# Altium project Module_Relay_UART_CAN.PrjPcb
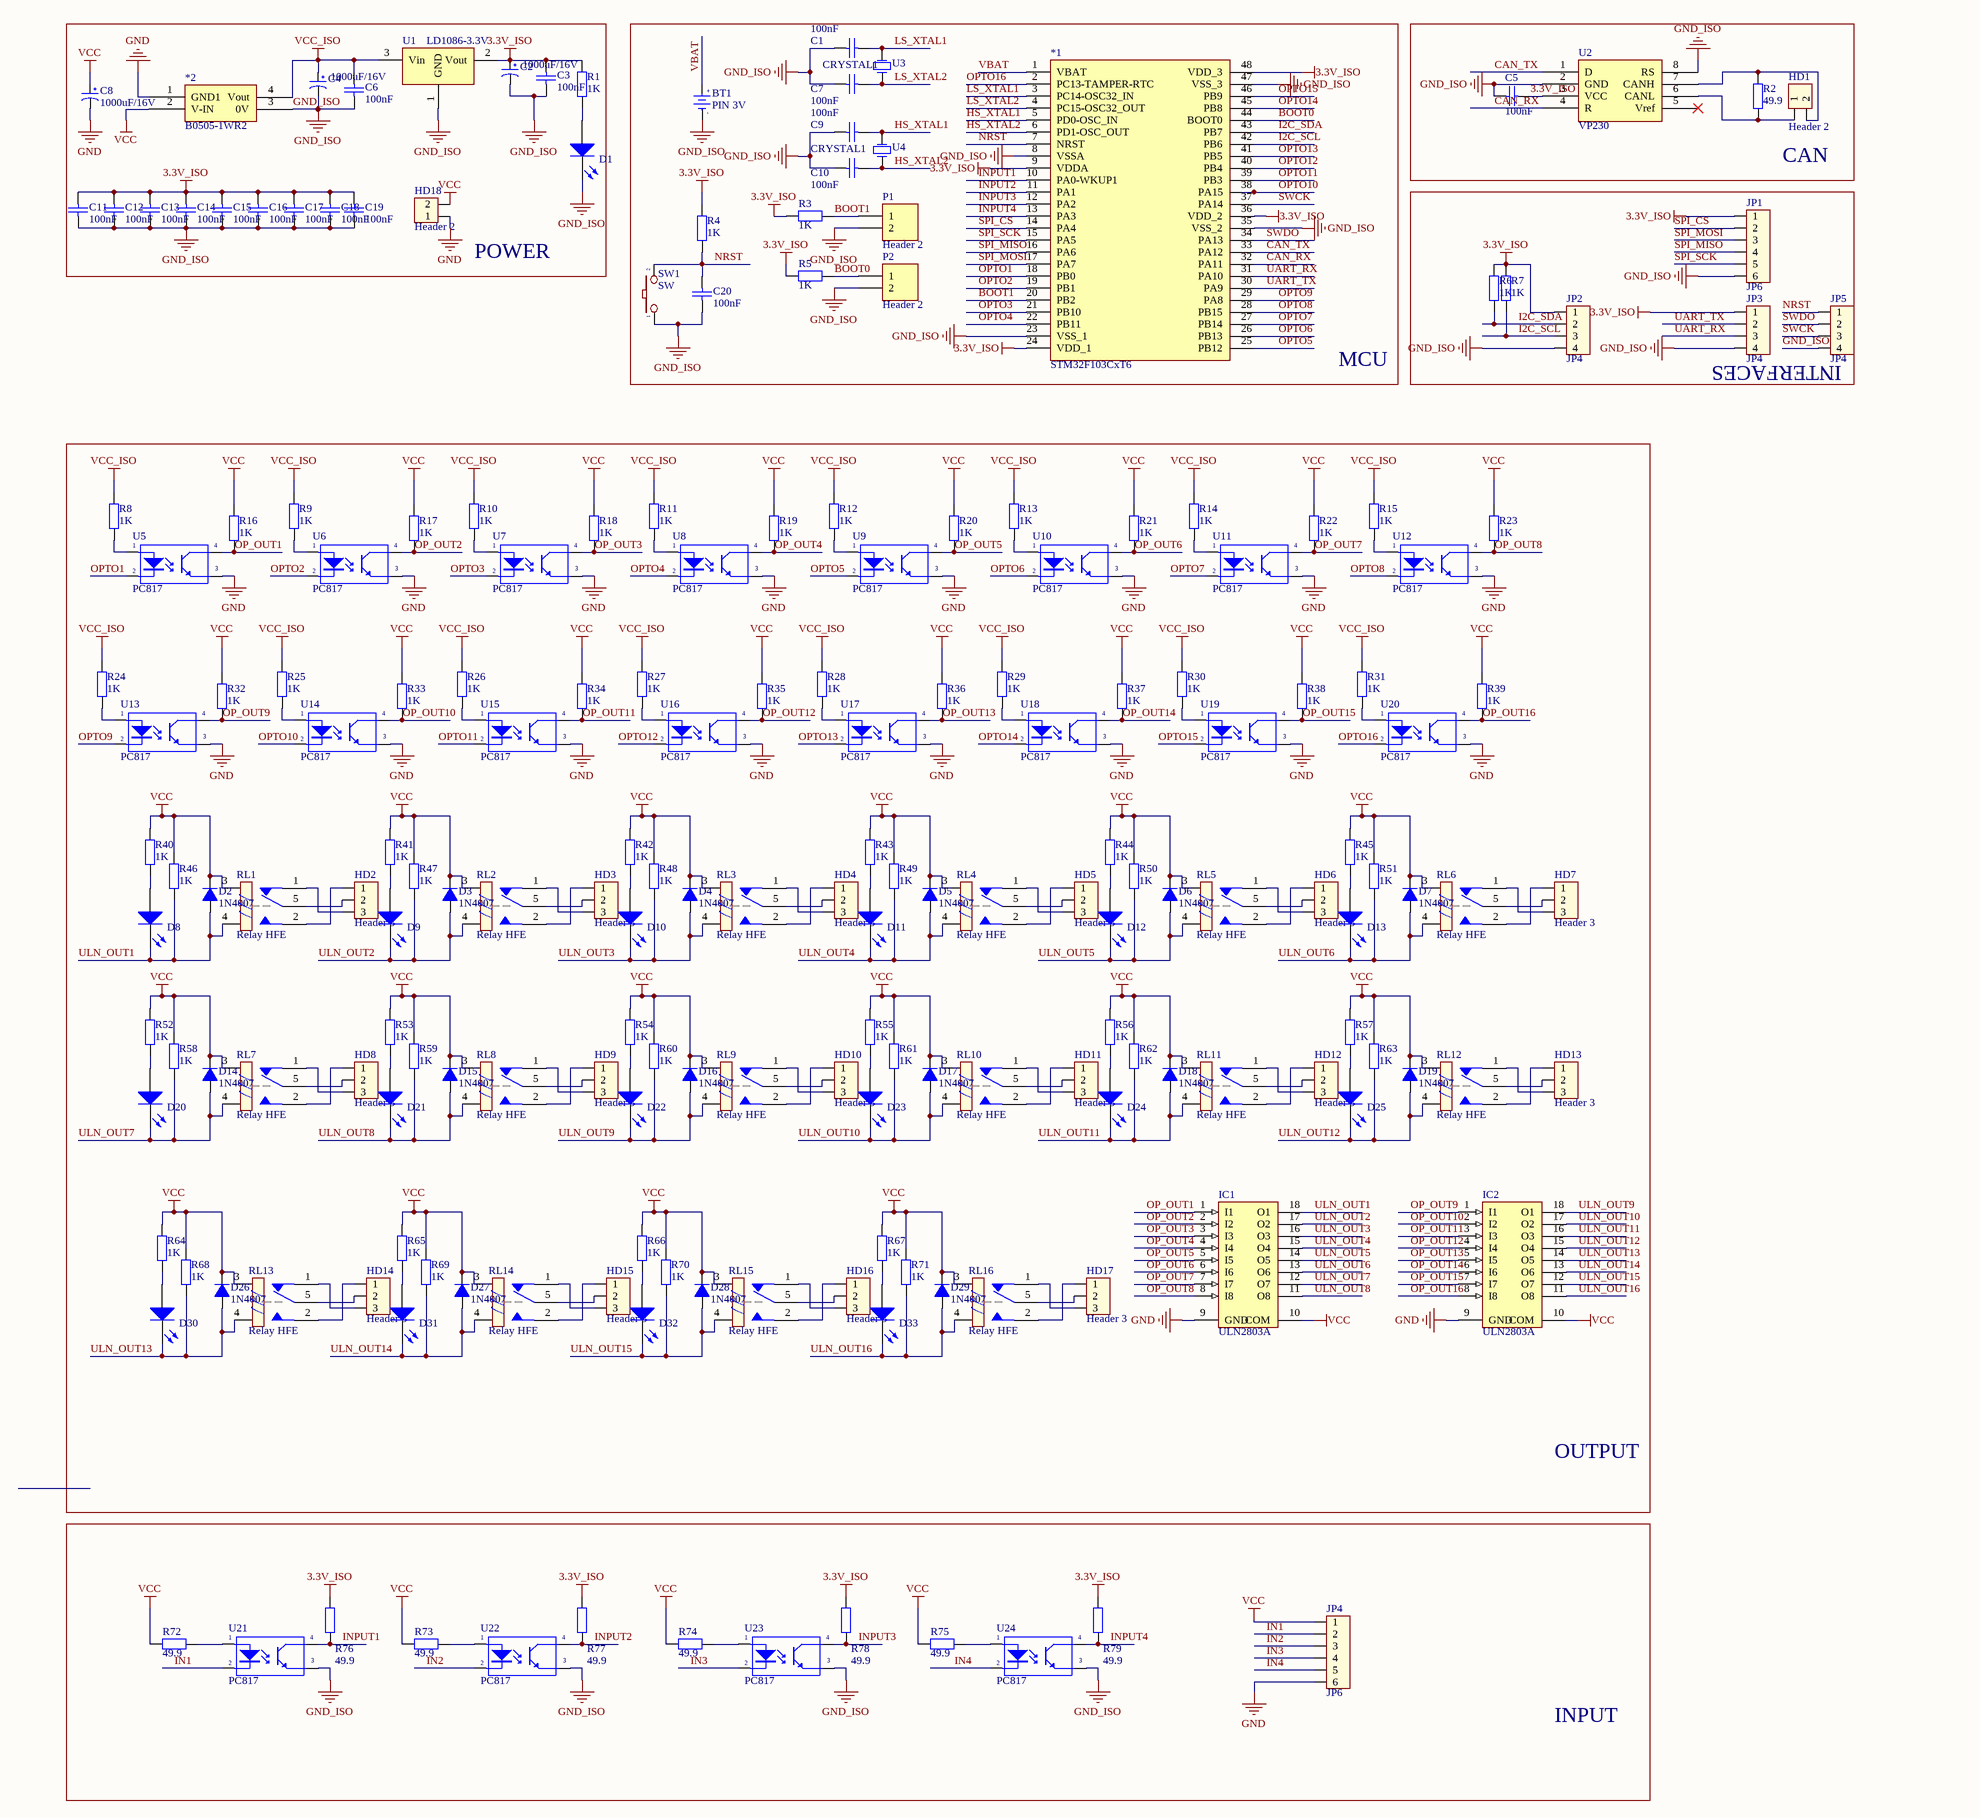
[diagram p0: Module_Relay_UART_CAN.SchDoc]
1 sheet, 203 parts. Net scope: global (net labels, ports and power ports of the same name join across sheets).
Board file: Module_Relay_UART_CAN.PcbDoc

## Sheet Module_Relay_UART_CAN.SchDoc
size A2

### Parts
*1  STM32F103CxT6  [LQFP48_N]
*2  B0505-1WR2  [B0505-1WR2]
BT1  PIN 3V  [CR1220]
C1  CAP: 100nF  [CAP0805]  (hidden comment: CAP)
C2  1000uF/16V  [CAP2917]
C3  CAP: 100nF  [CAP0805]  (hidden comment: CAP)
C4  1000uF/16V  [CAP2917]
C5  CAP: 100nF  [CAP0805]  (hidden comment: CAP)
C6  CAP: 100nF  [CAP0805]  (hidden comment: CAP)
C7  CAP: 100nF  [CAP0805]  (hidden comment: CAP)
C8  1000uF/16V  [CAP2917]
C9  CAP: 100nF  [CAP0805]  (hidden comment: CAP)
C10  CAP: 100nF  [CAP0805]  (hidden comment: CAP)
C11  CAP: 100nF  [CAP0805]  (hidden comment: CAP)
C12  CAP: 100nF  [CAP0805]  (hidden comment: CAP)
C13  CAP: 100nF  [CAP0805]  (hidden comment: CAP)
C14  CAP: 100nF  [CAP0805]  (hidden comment: CAP)
C15  CAP: 100nF  [CAP0805]  (hidden comment: CAP)
C16  CAP: 100nF  [CAP0805]  (hidden comment: CAP)
C17  CAP: 100nF  [CAP0805]  (hidden comment: CAP)
C18  CAP: 100nF  [CAP0805]  (hidden comment: CAP)
C19  CAP: 100nF  [CAP0805]  (hidden comment: CAP)
C20  CAP: 100nF  [CAP0805]  (hidden comment: CAP)
D1  LED  [LED0805]  (value not drawn)
D2  1N4007  [D1A]
D3  1N4007  [D1A]
D4  1N4007  [D1A]
D5  1N4007  [D1A]
D6  1N4007  [D1A]
D7  1N4007  [D1A]
D8  LED  [LED0805]  (value not drawn)
D9  LED  [LED0805]  (value not drawn)
D10  LED  [LED0805]  (value not drawn)
D11  LED  [LED0805]  (value not drawn)
D12  LED  [LED0805]  (value not drawn)
D13  LED  [LED0805]  (value not drawn)
D14  1N4007  [D1A]
D15  1N4007  [D1A]
D16  1N4007  [D1A]
D17  1N4007  [D1A]
D18  1N4007  [D1A]
D19  1N4007  [D1A]
D20  LED  [LED0805]  (value not drawn)
D21  LED  [LED0805]  (value not drawn)
D22  LED  [LED0805]  (value not drawn)
D23  LED  [LED0805]  (value not drawn)
D24  LED  [LED0805]  (value not drawn)
D25  LED  [LED0805]  (value not drawn)
D26  1N4007  [D1A]
D27  1N4007  [D1A]
D28  1N4007  [D1A]
D29  1N4007  [D1A]
D30  LED  [LED0805]  (value not drawn)
D31  LED  [LED0805]  (value not drawn)
D32  LED  [LED0805]  (value not drawn)
D33  LED  [LED0805]  (value not drawn)
HD1  Header 2  [HED2T]
HD2  Header 3  [HED3T]
HD3  Header 3  [HED3T]
HD4  Header 3  [HED3T]
HD5  Header 3  [HED3T]
HD6  Header 3  [HED3T]
HD7  Header 3  [HED3T]
HD8  Header 3  [HED3T]
HD9  Header 3  [HED3T]
HD10  Header 3  [HED3T]
HD11  Header 3  [HED3T]
HD12  Header 3  [HED3T]
HD13  Header 3  [HED3T]
HD14  Header 3  [HED3T]
HD15  Header 3  [HED3T]
HD16  Header 3  [HED3T]
HD17  Header 3  [HED3T]
HD18  Header 2  [HED2T]
IC1  ULN2803A  [SOP18]
IC2  ULN2803A  [SOP18]
JP1  JP6  [CON6]
JP2  JP4  [CON4]
JP3  JP4  [CON4]
JP4  JP6  [CON6]
JP5  JP4  [CON4]
P1  Header 2  [HDR1X2]
P2  Header 2  [HDR1X2]
R1  RES: 1K  [0805]  (hidden comment: RES)
R2  RES: 49.9  [0805]  (hidden comment: RES)
R3  RES: 1K  [0805]  (hidden comment: RES)
R4  RES: 1K  [0805]  (hidden comment: RES)
R5  RES: 1K  [0805]  (hidden comment: RES)
R6  RES: 1K  [0805]  (hidden comment: RES)
R7  RES: 1K  [0805]  (hidden comment: RES)
R8  RES: 1K  [0805]  (hidden comment: RES)
R9  RES: 1K  [0805]  (hidden comment: RES)
R10  RES: 1K  [0805]  (hidden comment: RES)
R11  RES: 1K  [0805]  (hidden comment: RES)
R12  RES: 1K  [0805]  (hidden comment: RES)
R13  RES: 1K  [0805]  (hidden comment: RES)
R14  RES: 1K  [0805]  (hidden comment: RES)
R15  RES: 1K  [0805]  (hidden comment: RES)
R16  RES: 1K  [0805]  (hidden comment: RES)
R17  RES: 1K  [0805]  (hidden comment: RES)
R18  RES: 1K  [0805]  (hidden comment: RES)
R19  RES: 1K  [0805]  (hidden comment: RES)
R20  RES: 1K  [0805]  (hidden comment: RES)
R21  RES: 1K  [0805]  (hidden comment: RES)
R22  RES: 1K  [0805]  (hidden comment: RES)
R23  RES: 1K  [0805]  (hidden comment: RES)
R24  RES: 1K  [0805]  (hidden comment: RES)
R25  RES: 1K  [0805]  (hidden comment: RES)
R26  RES: 1K  [0805]  (hidden comment: RES)
R27  RES: 1K  [0805]  (hidden comment: RES)
R28  RES: 1K  [0805]  (hidden comment: RES)
R29  RES: 1K  [0805]  (hidden comment: RES)
R30  RES: 1K  [0805]  (hidden comment: RES)
R31  RES: 1K  [0805]  (hidden comment: RES)
R32  RES: 1K  [0805]  (hidden comment: RES)
R33  RES: 1K  [0805]  (hidden comment: RES)
R34  RES: 1K  [0805]  (hidden comment: RES)
R35  RES: 1K  [0805]  (hidden comment: RES)
R36  RES: 1K  [0805]  (hidden comment: RES)
R37  RES: 1K  [0805]  (hidden comment: RES)
R38  RES: 1K  [0805]  (hidden comment: RES)
R39  RES: 1K  [0805]  (hidden comment: RES)
R40  RES: 1K  [0805]  (hidden comment: RES)
R41  RES: 1K  [0805]  (hidden comment: RES)
R42  RES: 1K  [0805]  (hidden comment: RES)
R43  RES: 1K  [0805]  (hidden comment: RES)
R44  RES: 1K  [0805]  (hidden comment: RES)
R45  RES: 1K  [0805]  (hidden comment: RES)
R46  RES: 1K  [0805]  (hidden comment: RES)
R47  RES: 1K  [0805]  (hidden comment: RES)
R48  RES: 1K  [0805]  (hidden comment: RES)
R49  RES: 1K  [0805]  (hidden comment: RES)
R50  RES: 1K  [0805]  (hidden comment: RES)
R51  RES: 1K  [0805]  (hidden comment: RES)
R52  RES: 1K  [0805]  (hidden comment: RES)
R53  RES: 1K  [0805]  (hidden comment: RES)
R54  RES: 1K  [0805]  (hidden comment: RES)
R55  RES: 1K  [0805]  (hidden comment: RES)
R56  RES: 1K  [0805]  (hidden comment: RES)
R57  RES: 1K  [0805]  (hidden comment: RES)
R58  RES: 1K  [0805]  (hidden comment: RES)
R59  RES: 1K  [0805]  (hidden comment: RES)
R60  RES: 1K  [0805]  (hidden comment: RES)
R61  RES: 1K  [0805]  (hidden comment: RES)
R62  RES: 1K  [0805]  (hidden comment: RES)
R63  RES: 1K  [0805]  (hidden comment: RES)
R64  RES: 1K  [0805]  (hidden comment: RES)
R65  RES: 1K  [0805]  (hidden comment: RES)
R66  RES: 1K  [0805]  (hidden comment: RES)
R67  RES: 1K  [0805]  (hidden comment: RES)
R68  RES: 1K  [0805]  (hidden comment: RES)
R69  RES: 1K  [0805]  (hidden comment: RES)
R70  RES: 1K  [0805]  (hidden comment: RES)
R71  RES: 1K  [0805]  (hidden comment: RES)
R72  RES: 49.9  [0805]  (hidden comment: RES)
R73  RES: 49.9  [0805]  (hidden comment: RES)
R74  RES: 49.9  [0805]  (hidden comment: RES)
R75  RES: 49.9  [0805]  (hidden comment: RES)
R76  RES: 49.9  [0805]  (hidden comment: RES)
R77  RES: 49.9  [0805]  (hidden comment: RES)
R78  RES: 49.9  [0805]  (hidden comment: RES)
R79  RES: 49.9  [0805]  (hidden comment: RES)
RL1  Relay HFE  [RELAY HFE]
RL2  Relay HFE  [RELAY HFE]
RL3  Relay HFE  [RELAY HFE]
RL4  Relay HFE  [RELAY HFE]
RL5  Relay HFE  [RELAY HFE]
RL6  Relay HFE  [RELAY HFE]
RL7  Relay HFE  [RELAY HFE]
RL8  Relay HFE  [RELAY HFE]
RL9  Relay HFE  [RELAY HFE]
RL10  Relay HFE  [RELAY HFE]
RL11  Relay HFE  [RELAY HFE]
RL12  Relay HFE  [RELAY HFE]
RL13  Relay HFE  [RELAY HFE]
RL14  Relay HFE  [RELAY HFE]
RL15  Relay HFE  [RELAY HFE]
RL16  Relay HFE  [RELAY HFE]
SW1  SW  [SW2PIN-HT]
U1  LD1086-3.3V  [SOT223_L]
U2  VP230  [SO-8]
U3  CRYSTAL1  [0805]
U4  CRYSTAL1  [CRYSTAL2]
U5  PC817  [DIP4/W0.3]
U6  PC817  [DIP4/W0.3]
U7  PC817  [DIP4/W0.3]
U8  PC817  [DIP4/W0.3]
U9  PC817  [DIP4/W0.3]
U10  PC817  [DIP4/W0.3]
U11  PC817  [DIP4/W0.3]
U12  PC817  [DIP4/W0.3]
U13  PC817  [DIP4/W0.3]
U14  PC817  [DIP4/W0.3]
U15  PC817  [DIP4/W0.3]
U16  PC817  [DIP4/W0.3]
U17  PC817  [DIP4/W0.3]
U18  PC817  [DIP4/W0.3]
U19  PC817  [DIP4/W0.3]
U20  PC817  [DIP4/W0.3]
U21  PC817  [DIP4/W0.3]
U22  PC817  [DIP4/W0.3]
U23  PC817  [DIP4/W0.3]
U24  PC817  [DIP4/W0.3]

### Blocks framed on the sheet
POWER: *2 C2-C4 C6 C8 C11-C19 D1 HD18 R1 U1
MCU: *1 BT1 C1 C7 C9 C10 C20 P1 P2 R3-R5 SW1 U3 U4
CAN: C5 HD1 R2 U2
INTERFACES: JP1-JP3 JP5 R6 R7
OUTPUT: D2-D33 HD2-HD17 IC1 IC2 R8-R71 RL1-RL16 U5-U20
INPUT: JP4 R72-R79 U21-U24

### Nets
3.3V_ISO: *1.9(VDDA) *1.24(VDD_1) *1.36(VDD_2) *1.48(VDD_3) C2.1 C3.1 C5.2 C11.1 C12.1 C13.1 C14.1 C15.1 C16.1 C17.1 C18.1 C19.1 JP1.1 JP2.1 JP3.1 R1.2 R3.2 R4.2 R5.2 R6.2 R7.2 R76.2 R77.2 R78.2 R79.2 U1.2(Vout) U2.3(VCC)
GND: *2.1(GND1) C8.2 HD18.1 IC1.9(GND) IC2.9(GND) JP4.6 U5.3(E) U6.3(E) U7.3(E) U8.3(E) U9.3(E) U10.3(E) U11.3(E) U12.3(E) U13.3(E) U14.3(E) U15.3(E) U16.3(E) U17.3(E) U18.3(E) U19.3(E) U20.3(E)
GND_ISO: *1.8(VSSA) *1.23(VSS_1) *1.35(VSS_2) *1.47(VSS_3) *2.3(0V) BT1.2(GND) C1.2 C2.2 C3.2 C4.2 C5.1 C6.2 C7.2 C9.2 C10.2 C11.2 C12.2 C13.2 C14.2 C15.2 C16.2 C17.2 C18.2 C19.2 C20.2 D1.2(K) JP1.6 JP2.4 JP3.4 JP5.4 P1.2 P2.2 SW1.1 U1.1(GND) U2.2(GND) U2.8(RS) U21.3(E) U22.3(E) U23.3(E) U24.3(E)
VCC: *2.2(V-IN) C8.1 D2.2(K) D3.2(K) D4.2(K) D5.2(K) D6.2(K) D7.2(K) D14.2(K) D15.2(K) D16.2(K) D17.2(K) D18.2(K) D19.2(K) D26.2(K) D27.2(K) D28.2(K) D29.2(K) HD18.2 IC1.10(COM) IC2.10(COM) JP4.1 R16.2 R17.2 R18.2 R19.2 R20.2 R21.2 R22.2 R23.2 R32.2 R33.2 R34.2 R35.2 R36.2 R37.2 R38.2 R39.2 R40.2 R41.2 R42.2 R43.2 R44.2 R45.2 R46.2 R47.2 R48.2 R49.2 R50.2 R51.2 R52.2 R53.2 R54.2 R55.2 R56.2 R57.2 R58.2 R59.2 R60.2 R61.2 R62.2 R63.2 R64.2 R65.2 R66.2 R67.2 R68.2 R69.2 R70.2 R71.2 R72.1 R73.1 R74.1 R75.1 RL1.3 RL2.3 RL3.3 RL4.3 RL5.3 RL6.3 RL7.3 RL8.3 RL9.3 RL10.3 RL11.3 RL12.3 RL13.3 RL14.3 RL15.3 RL16.3
VCC_ISO: *2.4(Vout) C4.1 C6.1 R8.1 R9.1 R10.1 R11.1 R12.1 R13.1 R14.1 R15.1 R24.1 R25.1 R26.1 R27.1 R28.1 R29.1 R30.1 R31.1 U1.3(Vin)
BOOT0: *1.44(BOOT0) P2.1 R5.1
BOOT1: *1.20(PB2) P1.1 R3.1
CAN_RX: *1.32(PA11) U2.4(R)
CAN_TX: *1.33(PA12) U2.1(D)
HS_XTAL1: *1.5(PD0-OSC_IN) C9.1 U4.2(OSC2)
HS_XTAL2: *1.6(PD1-OSC_OUT) C10.1 U4.1(OSC1)
I2C_SCL: *1.42(PB6) JP2.3 R7.1
I2C_SDA: *1.43(PB7) JP2.2 R6.1
IN1: JP4.2 U21.2(K)
IN2: JP4.3 U22.2(K)
IN3: JP4.4 U23.2(K)
IN4: JP4.5 U24.2(K)
INPUT1: *1.10(PA0-WKUP1) R76.1 U21.4(C)
INPUT2: *1.11(PA1) R77.1 U22.4(C)
INPUT3: *1.12(PA2) R78.1 U23.4(C)
INPUT4: *1.13(PA3) R79.1 U24.4(C)
LS_XTAL1: *1.3(PC14-OSC32_IN) C1.1 U3.2(OSC2)
LS_XTAL2: *1.4(PC15-OSC32_OUT) C7.1 U3.1(OSC1)
NRST: *1.7(NRST) C20.1 JP5.1 R4.1 SW1.2
OP_OUT1: IC1.1(I1) R16.1 U5.4(C)
OP_OUT2: IC1.2(I2) R17.1 U6.4(C)
OP_OUT3: IC1.3(I3) R18.1 U7.4(C)
OP_OUT4: IC1.4(I4) R19.1 U8.4(C)
OP_OUT5: IC1.5(I5) R20.1 U9.4(C)
OP_OUT6: IC1.6(I6) R21.1 U10.4(C)
OP_OUT7: IC1.7(I7) R22.1 U11.4(C)
OP_OUT8: IC1.8(I8) R23.1 U12.4(C)
OP_OUT9: IC2.1(I1) R32.1 U13.4(C)
OP_OUT10: IC2.2(I2) R33.1 U14.4(C)
OP_OUT11: IC2.3(I3) R34.1 U15.4(C)
OP_OUT12: IC2.4(I4) R35.1 U16.4(C)
OP_OUT13: IC2.5(I5) R36.1 U17.4(C)
OP_OUT14: IC2.6(I6) R37.1 U18.4(C)
OP_OUT15: IC2.7(I7) R38.1 U19.4(C)
OP_OUT16: IC2.8(I8) R39.1 U20.4(C)
OPTO1: *1.18(PB0) U5.2(K)
OPTO2: *1.19(PB1) U6.2(K)
OPTO3: *1.21(PB10) U7.2(K)
OPTO4: *1.22(PB11) U8.2(K)
OPTO5: *1.25(PB12) U9.2(K)
OPTO6: *1.26(PB13) U10.2(K)
OPTO7: *1.27(PB14) U11.2(K)
OPTO8: *1.28(PB15) U12.2(K)
OPTO9: *1.29(PA8) U13.2(K)
OPTO10: *1.38(PA15) U14.2(K)
OPTO11: *1.39(PB3) U15.2(K)
OPTO12: *1.40(PB4) U16.2(K)
OPTO13: *1.41(PB5) U17.2(K)
OPTO14: *1.45(PB8) U18.2(K)
OPTO15: *1.46(PB9) U19.2(K)
OPTO16: *1.2(PC13-TAMPER-RTC) U20.2(K)
SPI_CS: *1.14(PA4) JP1.2
SPI_MISO: *1.16(PA6) JP1.4
SPI_MOSI: *1.17(PA7) JP1.3
SPI_SCK: *1.15(PA5) JP1.5
SWCK: *1.37(PA14) JP5.3
SWDO: *1.34(PA13) JP5.2
UART_RX: *1.31(PA10) JP3.3
UART_TX: *1.30(PA9) JP3.2
ULN_OUT1: D2.1(A) D8.2(K) IC1.18(O1) R46.1 RL1.4
ULN_OUT2: D3.1(A) D9.2(K) IC1.17(O2) R47.1 RL2.4
ULN_OUT3: D4.1(A) D10.2(K) IC1.16(O3) R48.1 RL3.4
ULN_OUT4: D5.1(A) D11.2(K) IC1.15(O4) R49.1 RL4.4
ULN_OUT5: D6.1(A) D12.2(K) IC1.14(O5) R50.1 RL5.4
ULN_OUT6: D7.1(A) D13.2(K) IC1.13(O6) R51.1 RL6.4
ULN_OUT7: D14.1(A) D20.2(K) IC1.12(O7) R58.1 RL7.4
ULN_OUT8: D15.1(A) D21.2(K) IC1.11(O8) R59.1 RL8.4
ULN_OUT9: D16.1(A) D22.2(K) IC2.18(O1) R60.1 RL9.4
ULN_OUT10: D17.1(A) D23.2(K) IC2.17(O2) R61.1 RL10.4
ULN_OUT11: D18.1(A) D24.2(K) IC2.16(O3) R62.1 RL11.4
ULN_OUT12: D19.1(A) D25.2(K) IC2.15(O4) R63.1 RL12.4
ULN_OUT13: D26.1(A) D30.2(K) IC2.14(O5) R68.1 RL13.4
ULN_OUT14: D27.1(A) D31.2(K) IC2.13(O6) R69.1 RL14.4
ULN_OUT15: D28.1(A) D32.2(K) IC2.12(O7) R70.1 RL15.4
ULN_OUT16: D29.1(A) D33.2(K) IC2.11(O8) R71.1 RL16.4
VBAT: *1.1(VBAT) BT1.1(+3V)
NetD1_1: D1.1(A) R1.1
NetD8_1: D8.1(A) R40.1
NetD9_1: D9.1(A) R41.1
NetD10_1: D10.1(A) R42.1
NetD11_1: D11.1(A) R43.1
NetD12_1: D12.1(A) R44.1
NetD13_1: D13.1(A) R45.1
NetD20_1: D20.1(A) R52.1
NetD21_1: D21.1(A) R53.1
NetD22_1: D22.1(A) R54.1
NetD23_1: D23.1(A) R55.1
NetD24_1: D24.1(A) R56.1
NetD25_1: D25.1(A) R57.1
NetD30_1: D30.1(A) R64.1
NetD31_1: D31.1(A) R65.1
NetD32_1: D32.1(A) R66.1
NetD33_1: D33.1(A) R67.1
NetHD1_1: HD1.1 R2.2 U2.6(CANL)
NetHD1_2: HD1.2 R2.1 U2.7(CANH)
NetHD2_1: HD2.1 RL1.2
NetHD2_2: HD2.2 RL1.5
NetHD2_3: HD2.3 RL1.1
NetHD3_1: HD3.1 RL2.2
NetHD3_2: HD3.2 RL2.5
NetHD3_3: HD3.3 RL2.1
NetHD4_1: HD4.1 RL3.2
NetHD4_2: HD4.2 RL3.5
NetHD4_3: HD4.3 RL3.1
NetHD5_1: HD5.1 RL4.2
NetHD5_2: HD5.2 RL4.5
NetHD5_3: HD5.3 RL4.1
NetHD6_1: HD6.1 RL5.2
NetHD6_2: HD6.2 RL5.5
NetHD6_3: HD6.3 RL5.1
NetHD7_1: HD7.1 RL6.2
NetHD7_2: HD7.2 RL6.5
NetHD7_3: HD7.3 RL6.1
NetHD8_1: HD8.1 RL7.2
NetHD8_2: HD8.2 RL7.5
NetHD8_3: HD8.3 RL7.1
NetHD9_1: HD9.1 RL8.2
NetHD9_2: HD9.2 RL8.5
NetHD9_3: HD9.3 RL8.1
NetHD10_1: HD10.1 RL9.2
NetHD10_2: HD10.2 RL9.5
NetHD10_3: HD10.3 RL9.1
NetHD11_1: HD11.1 RL10.2
NetHD11_2: HD11.2 RL10.5
NetHD11_3: HD11.3 RL10.1
NetHD12_1: HD12.1 RL11.2
NetHD12_2: HD12.2 RL11.5
NetHD12_3: HD12.3 RL11.1
NetHD13_1: HD13.1 RL12.2
NetHD13_2: HD13.2 RL12.5
NetHD13_3: HD13.3 RL12.1
NetHD14_1: HD14.1 RL13.2
NetHD14_2: HD14.2 RL13.5
NetHD14_3: HD14.3 RL13.1
NetHD15_1: HD15.1 RL14.2
NetHD15_2: HD15.2 RL14.5
NetHD15_3: HD15.3 RL14.1
NetHD16_1: HD16.1 RL15.2
NetHD16_2: HD16.2 RL15.5
NetHD16_3: HD16.3 RL15.1
NetHD17_1: HD17.1 RL16.2
NetHD17_2: HD17.2 RL16.5
NetHD17_3: HD17.3 RL16.1
NetR8_2: R8.2 U5.1(A)
NetR9_2: R9.2 U6.1(A)
NetR10_2: R10.2 U7.1(A)
NetR11_2: R11.2 U8.1(A)
NetR12_2: R12.2 U9.1(A)
NetR13_2: R13.2 U10.1(A)
NetR14_2: R14.2 U11.1(A)
NetR15_2: R15.2 U12.1(A)
NetR24_2: R24.2 U13.1(A)
NetR25_2: R25.2 U14.1(A)
NetR26_2: R26.2 U15.1(A)
NetR27_2: R27.2 U16.1(A)
NetR28_2: R28.2 U17.1(A)
NetR29_2: R29.2 U18.1(A)
NetR30_2: R30.2 U19.1(A)
NetR31_2: R31.2 U20.1(A)
NetR72_2: R72.2 U21.1(A)
NetR73_2: R73.2 U22.1(A)
NetR74_2: R74.2 U23.1(A)
NetR75_2: R75.2 U24.1(A)

Not connected (* = marked no-connect by the designer): U2 5(Vref)*

### Notes on the sheet
- (in symbol PIN 3V) +; -

### Library data of the parts
BT1 = PIN 3V: Battery 3VDC; Value: PIN 3V
C2 C4 C8 = CP4: Cap 1000uF/16V - 220uF/50V; Description 5: 4,7uF>10uF/250V_3,3uF>10uF/400V - 2,2uF>4,7uF/450V; Description 1: 2200uF-3300uF/6,3V - 1000uF-2200uF/10V; Description 2: 1000uF/16V - 470uF => 1000uF/25V - 100uF/100V; Description 3: 330uF>470uF/35V_220uF>470uF/50V_10uF>22uF/250V; Description 4: 220uF => 330uF/63V - 10uF =>33uF/160 - 200V; Value: 1000uF/16V
D1 D8-D13 D20-D25 D30-D33 = LED1
D2-D7 D14-D19 D26-D29 = D1A: Diode 1A; Value: 1N4007
HD1 HD18 = Hed2: Header 2 (Green); Value: Header 2
HD2-HD17 = Hed3: Header 3 (Green); Value: Header 3
IC1 IC2 = ULN2803A: High-Voltage, High-Current Darlington Array; LatestRevisionNote: Stylized 3D Model Added.; Publisher: Altium Limited; Value: ULN2803A
JP1 JP4 = Con6: Connector 6; Value: Connector 6
JP2 JP3 JP5 = Con4: Connector 4; Value: Connector 4
P1 P2 = Header 2: Header, 2-Pin; LatestRevisionDate: 17-Jul-2002; LatestRevisionNote: Re-released for DXP Platform.; Publisher: Altium Limited
RL1-RL16 = Relay HFE: Relay SPDT,10A - 12VDC 5 Pin; Value: Relay SPDT, 10A, 12V
SW1 = SW2: Switch button 2 pin; Value: SW chip 2 pin
U1 = AP1117_3V3
U2 = SN65HVD230
U5-U24 = PC817: Single Opto; Value: PC817